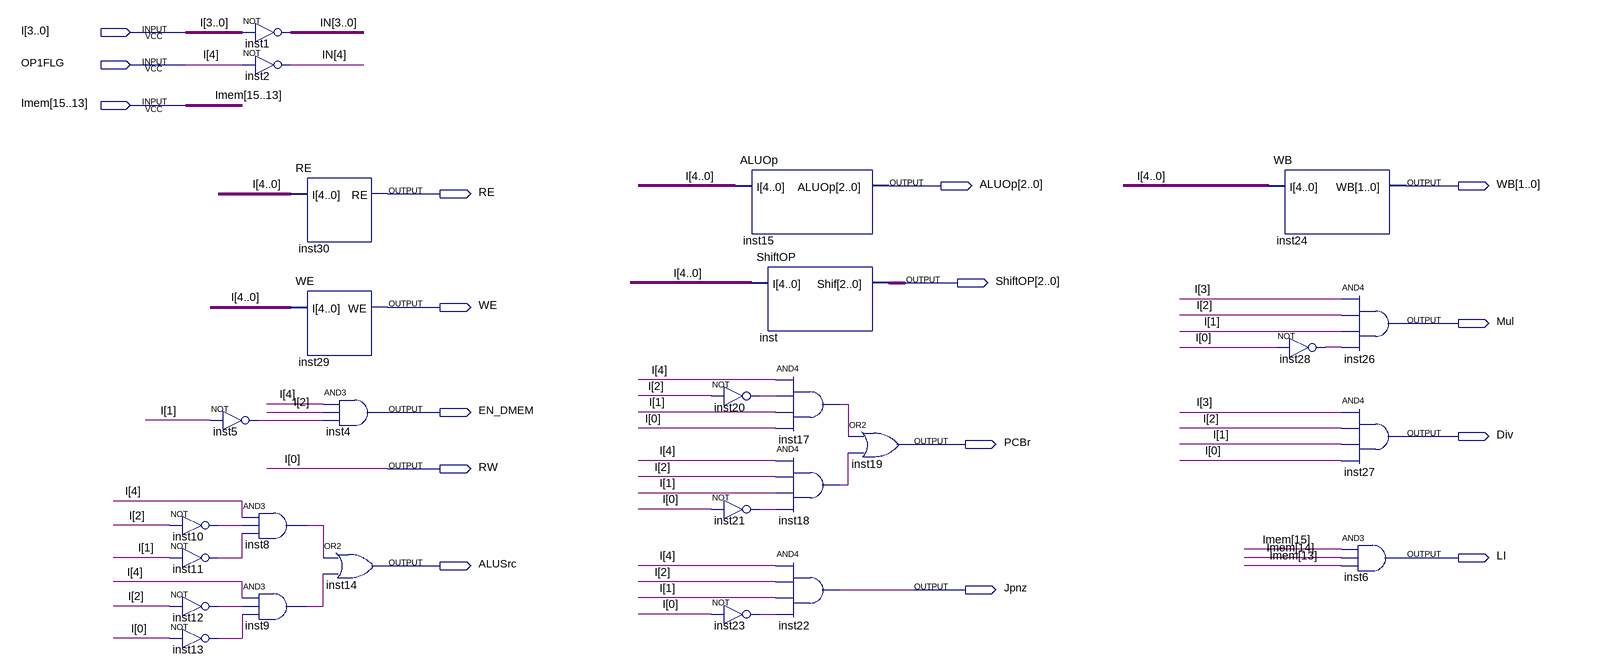
[diagram p0: schematic sheet]
// Quartus schematic OP_Func_def.bdf as structural Verilog: 27 symbols, 16 pins
module OP_Func_def (
  input  [3:0] I,
  input  OP1FLG,
  input  [15:13] Imem,
  output [2:0] ALUOp,
  output [1:0] WB,
  output RE,
  output [2:0] ShiftOP,
  output WE,
  output Mul,
  output EN_DMEM,
  output Div,
  output PCBr,
  output RW,
  output LI,
  output ALUSrc,
  output Jpnz
);

  wire inst5_out, inst8_out, inst9_out, inst10_out, inst11_out, inst12_out, inst13_out, inst17_out,
       inst18_out, inst20_out, inst21_out, inst23_out, inst28_out;
  wire [4:0] IN;

  not inst10 (inst10_out, I[2]);
  not inst11 (inst11_out, I[1]);
  not inst12 (inst12_out, I[2]);
  not inst13 (inst13_out, I[0]);
  assign IN[3:0] = ~I;  // NOT inst1, 4 bits wide
  not inst2 (IN[4], OP1FLG);
  not inst5 (inst5_out, I[1]);
  and inst8 (inst8_out, OP1FLG, inst10_out, inst11_out);
  and inst9 (inst9_out, OP1FLG, inst12_out, inst13_out);
  RE inst30 (.I({OP1FLG, I}), .RE(RE));
  WE inst29 (.I({OP1FLG, I}), .WE(WE));
  and inst4 (EN_DMEM, OP1FLG, I[2], inst5_out);
  or inst14 (ALUSrc, inst8_out, inst9_out);
  not inst20 (inst20_out, I[2]);
  not inst21 (inst21_out, I[0]);
  not inst23 (inst23_out, I[0]);
  ALUOp inst15 (.I({OP1FLG, I}), .ALUOp(ALUOp));
  ShiftOP inst (.I({OP1FLG, I}), .Shif(ShiftOP));
  and inst17 (inst17_out, OP1FLG, inst20_out, I[1], I[0]);
  and inst18 (inst18_out, OP1FLG, I[2], I[1], inst21_out);
  and inst22 (Jpnz, OP1FLG, I[2], I[1], inst23_out);
  or inst19 (PCBr, inst17_out, inst18_out);
  WB inst24 (.I({OP1FLG, I}), .WB(WB));
  not inst28 (inst28_out, I[0]);
  and inst26 (Mul, I[3], I[2], I[1], inst28_out);
  and inst27 (Div, I[3], I[2], I[1], I[0]);
  and inst6 (LI, Imem[15], Imem[14], Imem[13]);

  assign RW = I[0];

  // Other names for the same wires on the sheet: I[4] = OP1FLG
endmodule
